# Altium schematic sheet Power Conversion.SchDoc
size A4
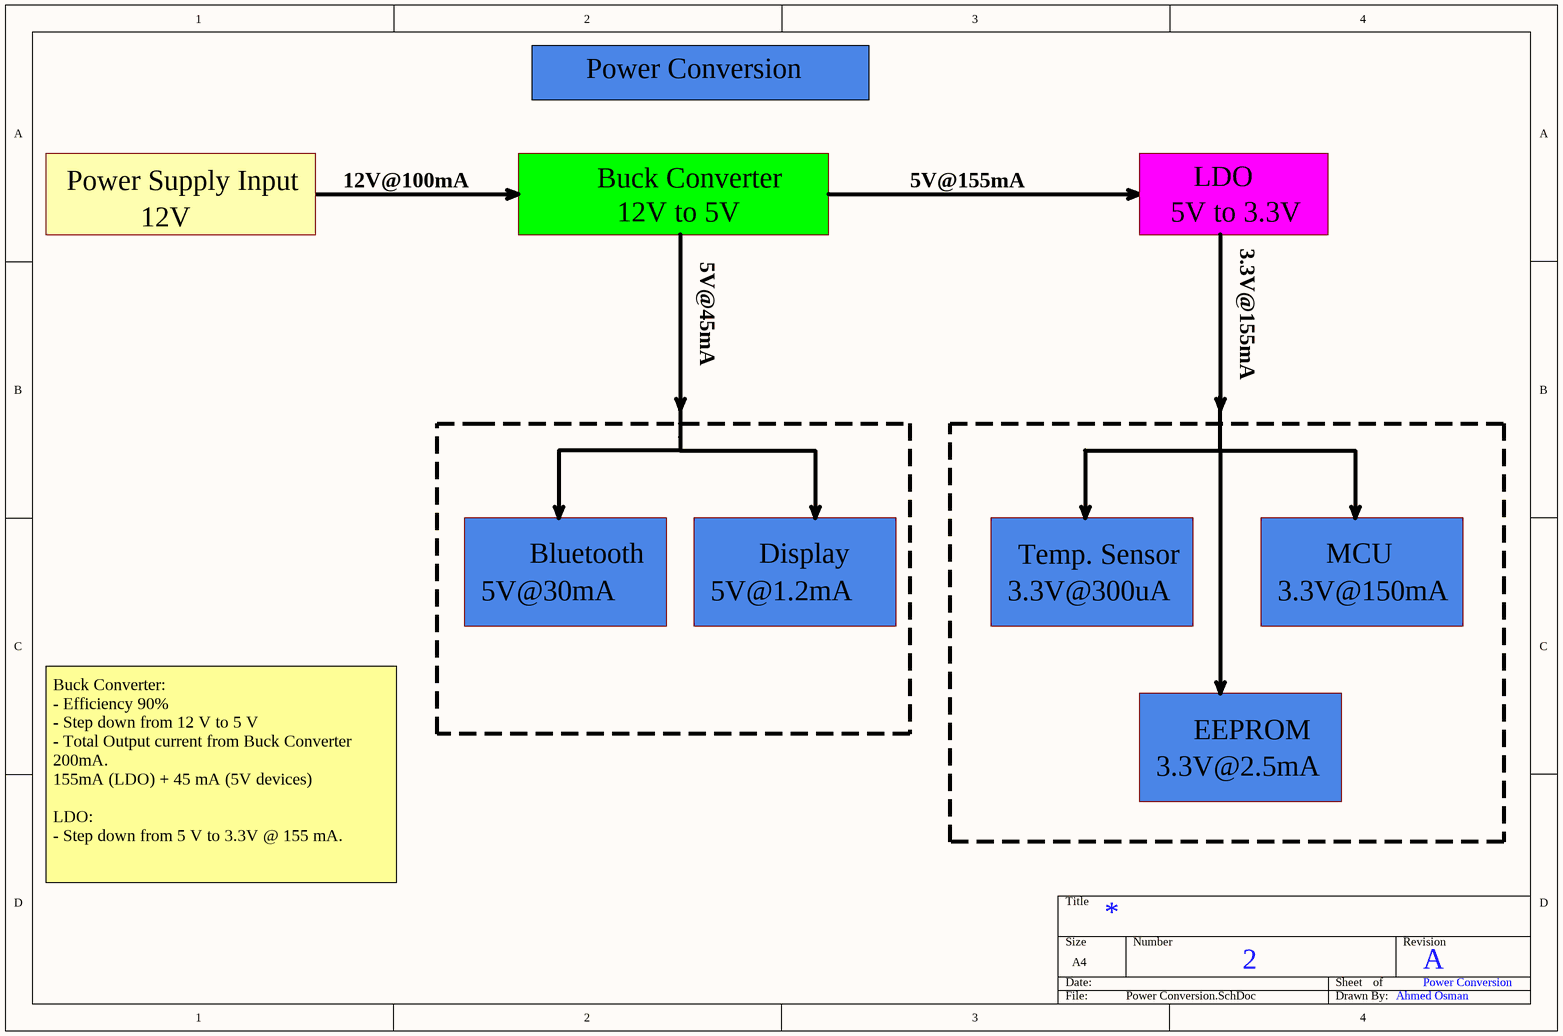
[diagram p0: Power Conversion.SchDoc]

## Notes on the sheet
- Power Conversion
- Power Supply Input
- 12V
- 12V@100mA
- Buck Converter
- 12V to 5V
- 5V@155mA
- 5V to 3.3V
- LDO
- 3.3V@155mA
- 5V@45mA
- Bluetooth
- Display
- Temp. Sensor
- MCU
- 5V@30mA
- 5V@1.2mA
- 3.3V@300uA
- 3.3V@150mA
- 3.3V@2.5mA
- EEPROM
- Buck Converter:
  - Efficiency 90%
  - Step down from 12 V to 5 V
  - Total Output current from Buck Converter 200mA.
  155mA (LDO) + 45 mA (5V devices)
  LDO:
  - Step down from 5 V to 3.3V @ 155 mA.
- 2
- A
- Ahmed Osman